# EAGLE design board (EAGLE 9.6.2)
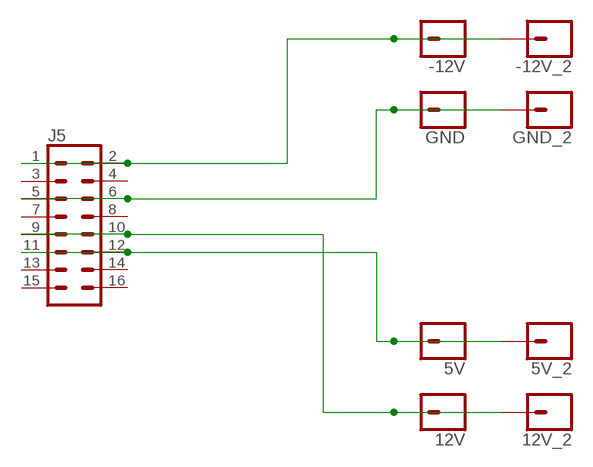
[diagram p0: schematic, sheet 1]

## Parts
5V  CONN_01  [1X01]
5V_2  CONN_01  [1X01]
12V  CONN_01  [1X01]
12V_2  CONN_01  [1X01]
-12V  CONN_01  [1X01]
-12V_2  CONN_01  [1X01]
GND  CONN_01  [1X01]
GND_2  CONN_01  [1X01]
J5  CONN_08X2  [2X8]

## Nets
N$1: -12V.1 -12V_2.1 J5.1 J5.2
N$2: GND.1 GND_2.1 J5.5 J5.6
N$3: 12V.1 12V_2.1 J5.9 J5.10
N$4: 5V.1 5V_2.1 J5.11 J5.12
Unconnected: J5.3 J5.4 J5.7 J5.8 J5.13 J5.14 J5.15 J5.16

## Library data of the parts
5V 5V_2 12V 12V_2 -12V -12V_2 GND GND_2 = SparkFun-Connectors:CONN_01: Single connection point. Often used as Generic Header-pin footprint for 0.1 inch spaced/style header connections On any of the 0.1 inch spaced packages, you can populate with these: Break Away Headers - Straight <https://www.sparkfun.com/products/116> (PRT-00116) Break Away Male Headers - Right Angle <https://www.sparkfun.com/products/553> (PRT-00553) Female Headers <https://www.sparkfun.com/products/115> (PRT-00115) Break Away Headers - Machine Pin <https://www.sparkfun.com/products/117> (PRT-00117) Break Away Female Headers - Swiss Machine Pin <https://www.sparkfun.com/products/743> (PRT-00743) This device is also useful as a general connection point to wire up your design to another part of your project. Our various solder wires solder well into these plated through hole pads. Hook-Up Wire - Assortment (Stranded, 22 AWG) <https://www.sparkfun.com/products/11375> (PRT-11375) Hook-Up Wire - Assortment (Solid Core, 22 AWG) <https://www.sparkfun.com/products/11367> (PRT-11367) View the entire wire category on our website here <https://www.sparkfun.com/categories/141> Special notes: SMTSO-256-ET is a "flush mount" nut for a 4-40 screw. We mostly use this on specialty testbeds; it is a nice way to connect hardware to your PCB at an adjustable hieght. Also note, the SNAP packages are for using a snappable style connector. We sell a baggie of snaps and they are also used on two LilyPad designs: Snap Assortment - 30 pack (male and female) <https://www.sparkfun.com/products/11347> (DEV-11347) LilyPad Arduino SimpleSnap <https://www.sparkfun.com/products/10941> (DEV-10941) LilyPad SimpleSnap Protoboard <https://www.sparkfun.com/products/10940> (DEV-10940)
J5 = SparkFun-Connectors:CONN_08X2: Multi connection point. Often used as Generic Header-pin footprint for 0.1 inch spaced/style header connections You can populate with any combo of single row headers, but if you'd like an exact match, check this: Header - 2x8 (Male, 0.1") <https://www.sparkfun.com/products/13156> (PRT-13156) On any of the 0.1 inch spaced packages, you can populate with these: Break Away Headers - Straight <https://www.sparkfun.com/products/116> (PRT-00116) Break Away Male Headers - Right Angle <https://www.sparkfun.com/products/553> (PRT-00553) Female Headers <https://www.sparkfun.com/products/115> (PRT-00115) Break Away Headers - Machine Pin <https://www.sparkfun.com/products/117> (PRT-00117) Break Away Female Headers - Swiss Machine Pin <https://www.sparkfun.com/products/743> (PRT-00743)

## Board
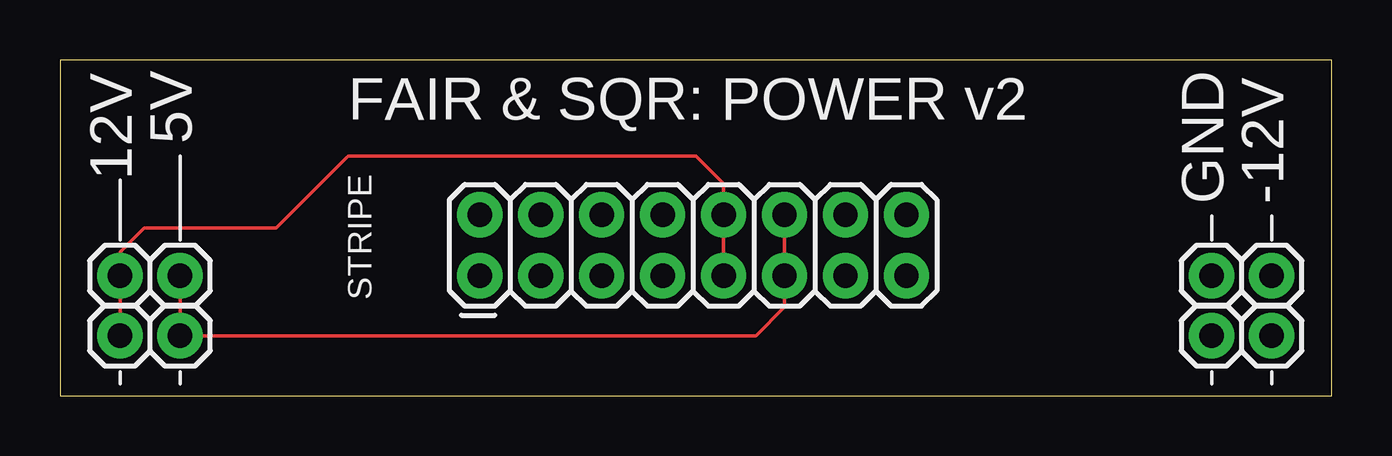
[diagram p1: board, top side]
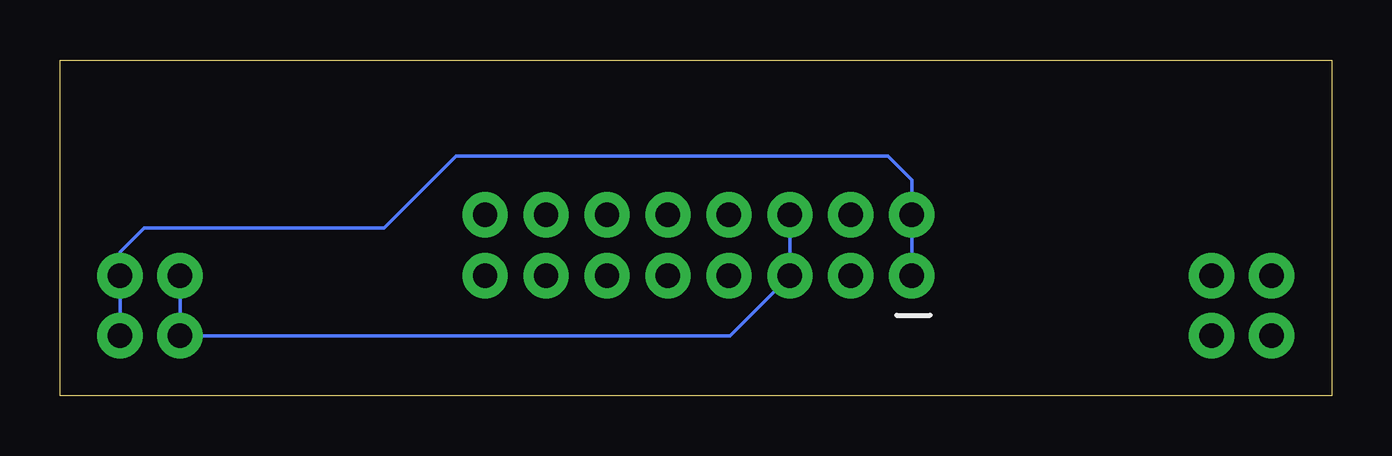
[diagram p2: board, bottom side, seen from below]

Size 53 x 14 mm. Coordinates in mm from the lower left corner, seen from the top.
Outline: 0,0 53,0 53,14 0,14 0,0
Copper layers (1*16): Top 0.035mm / dielectric 1.5mm / Bottom 0.035mm
Design rules "default": minimum track width 6mil, minimum drill 0.35mm, track to track 6mil, track to pad 6mil, pad to pad 6mil, via to via 6mil, smd to smd 6mil, copper to edge 40mil, drill to drill 6mil, minimum pad ring 10mil, minimum via ring 8mil, stop-mask expansion 4mil, vias tented up to drill 0mil, thermal gap 10mil

### Footprints (pad centres in the part's own frame; a part is rotated, then mirrored left to right if it is on the bottom)
1X01 = drill 1.016 pad 1.88: 1 0,0
2X8 = drill 1.016 pad 1.88: 1 0,0; 2 0,2.54; 3 2.54,0; 4 2.54,2.54; 5 5.08,0; 6 5.08,2.54; 7 7.62,0; 8 7.62,2.54; 9 10.16,0; 10 10.16,2.54; 11 12.7,0; 12 12.7,2.54; 13 15.24,0; 14 15.24,2.54; 15 17.78,0; 16 17.78,2.54

### Placement (x,y rotation side)
5V  5,2.5 0 top
5V_2  5,5 0 top
12V  2.5,2.5 0 top
12V_2  2.5,5 0 top
-12V  50.5,2.5 0 top
-12V_2  50.5,5 0 top
GND  48,2.5 0 top
GND_2  48,5 0 top
J5  17.5,5 0 top

### Tracks (layer width: path | path; a pad name or v marks a point on that pad's centre or on a via)
N$1
  Bottom 0.152: J5.1 J5.2 17.5,9 18.5,10 36.5,10 39.5,7 49.5,7 50.5,6 -12V_2.1 -12V.1
N$2
  Bottom 0.152: GND_2.1 GND.1 25.08,2.5 J5.5 J5.6
N$3
  Top 0.152: 12V.1 12V_2.1 2.5,6 3.5,7 9,7 12,10 26.5,10 27.66,8.84 J5.10 J5.9
N$4
  Top 0.152: 5V_2.1 5V.1 29,2.5 30.2,3.7 J5.11 J5.12

### Text on the board
tPlace: FAIR & SQR: POWER v2 | 5V | 12V | GND | -12V | STRIPE